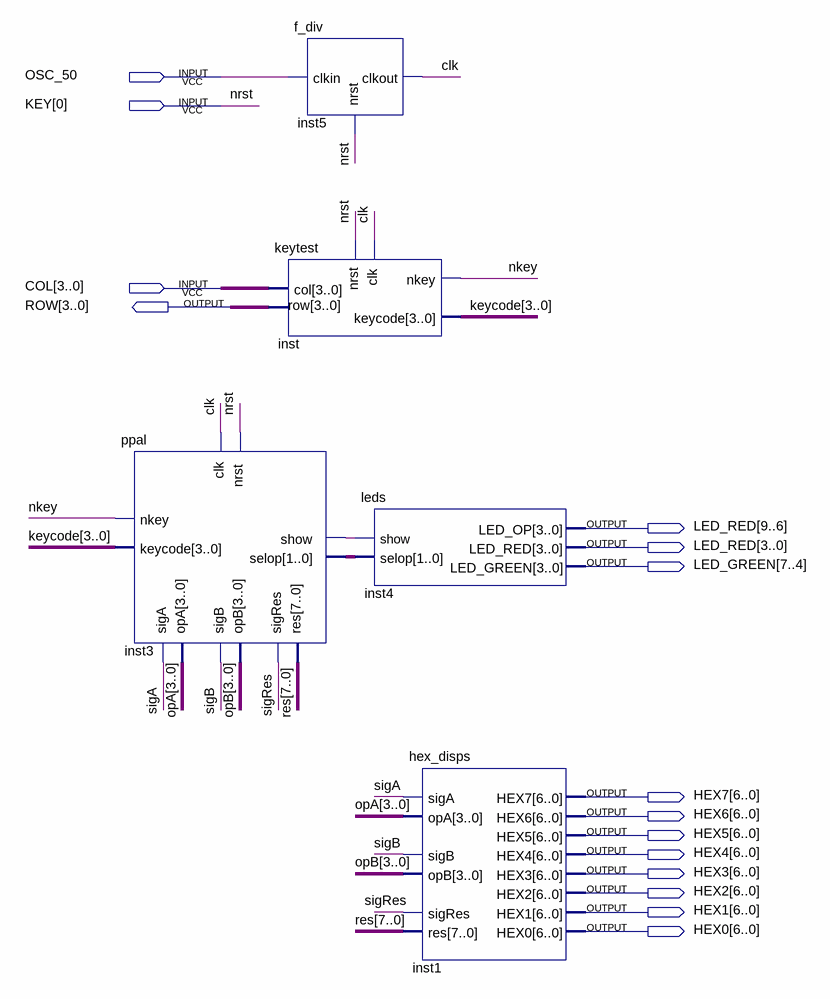
[diagram p0: schematic sheet]
// Quartus schematic calc.bdf as structural Verilog: 5 symbols, 15 pins
module calc (
  input  OSC_50,
  input  [0:0] KEY,
  input  [3:0] COL,
  output [3:0] ROW,
  output [9:0] LED_RED,
  output [7:4] LED_GREEN,
  output [6:0] HEX7,
  output [6:0] HEX6,
  output [6:0] HEX5,
  output [6:0] HEX4,
  output [6:0] HEX3,
  output [6:0] HEX2,
  output [6:0] HEX1,
  output [6:0] HEX0
);

  wire clk, inst3_show, nkey, sigA, sigB, sigRes;
  wire [1:0] inst3_selop;
  wire [3:0] keycode, opA, opB;
  wire [7:0] res;

  ppal inst3 (
    .nkey(nkey), .keycode(keycode), .clk(clk), .nrst(KEY[0]), .show(inst3_show), .selop(inst3_selop),
    .sigA(sigA), .opA(opA), .sigB(sigB), .opB(opB), .sigRes(sigRes), .res(res));
  f_div inst5 (.nrst(KEY[0]), .clkin(OSC_50), .clkout(clk));
  keytest inst (.clk(clk), .nrst(KEY[0]), .col(COL), .nkey(nkey), .keycode(keycode), .row(ROW));
  leds inst4 (
    .show(inst3_show), .selop(inst3_selop), .LED_GREEN(LED_GREEN), .LED_OP(LED_RED[9:6]),
    .LED_RED(LED_RED[3:0]));
  hex_disps inst1 (
    .sigA(sigA), .sigB(sigB), .sigRes(sigRes), .opA(opA), .opB(opB), .res(res), .HEX7(HEX7), .HEX6(HEX6),
    .HEX5(HEX5), .HEX4(HEX4), .HEX3(HEX3), .HEX2(HEX2), .HEX1(HEX1), .HEX0(HEX0));

  // Other names for the same wires on the sheet: nrst = KEY[0]
endmodule
